# EAGLE design 6502 board (EAGLE 6.1)
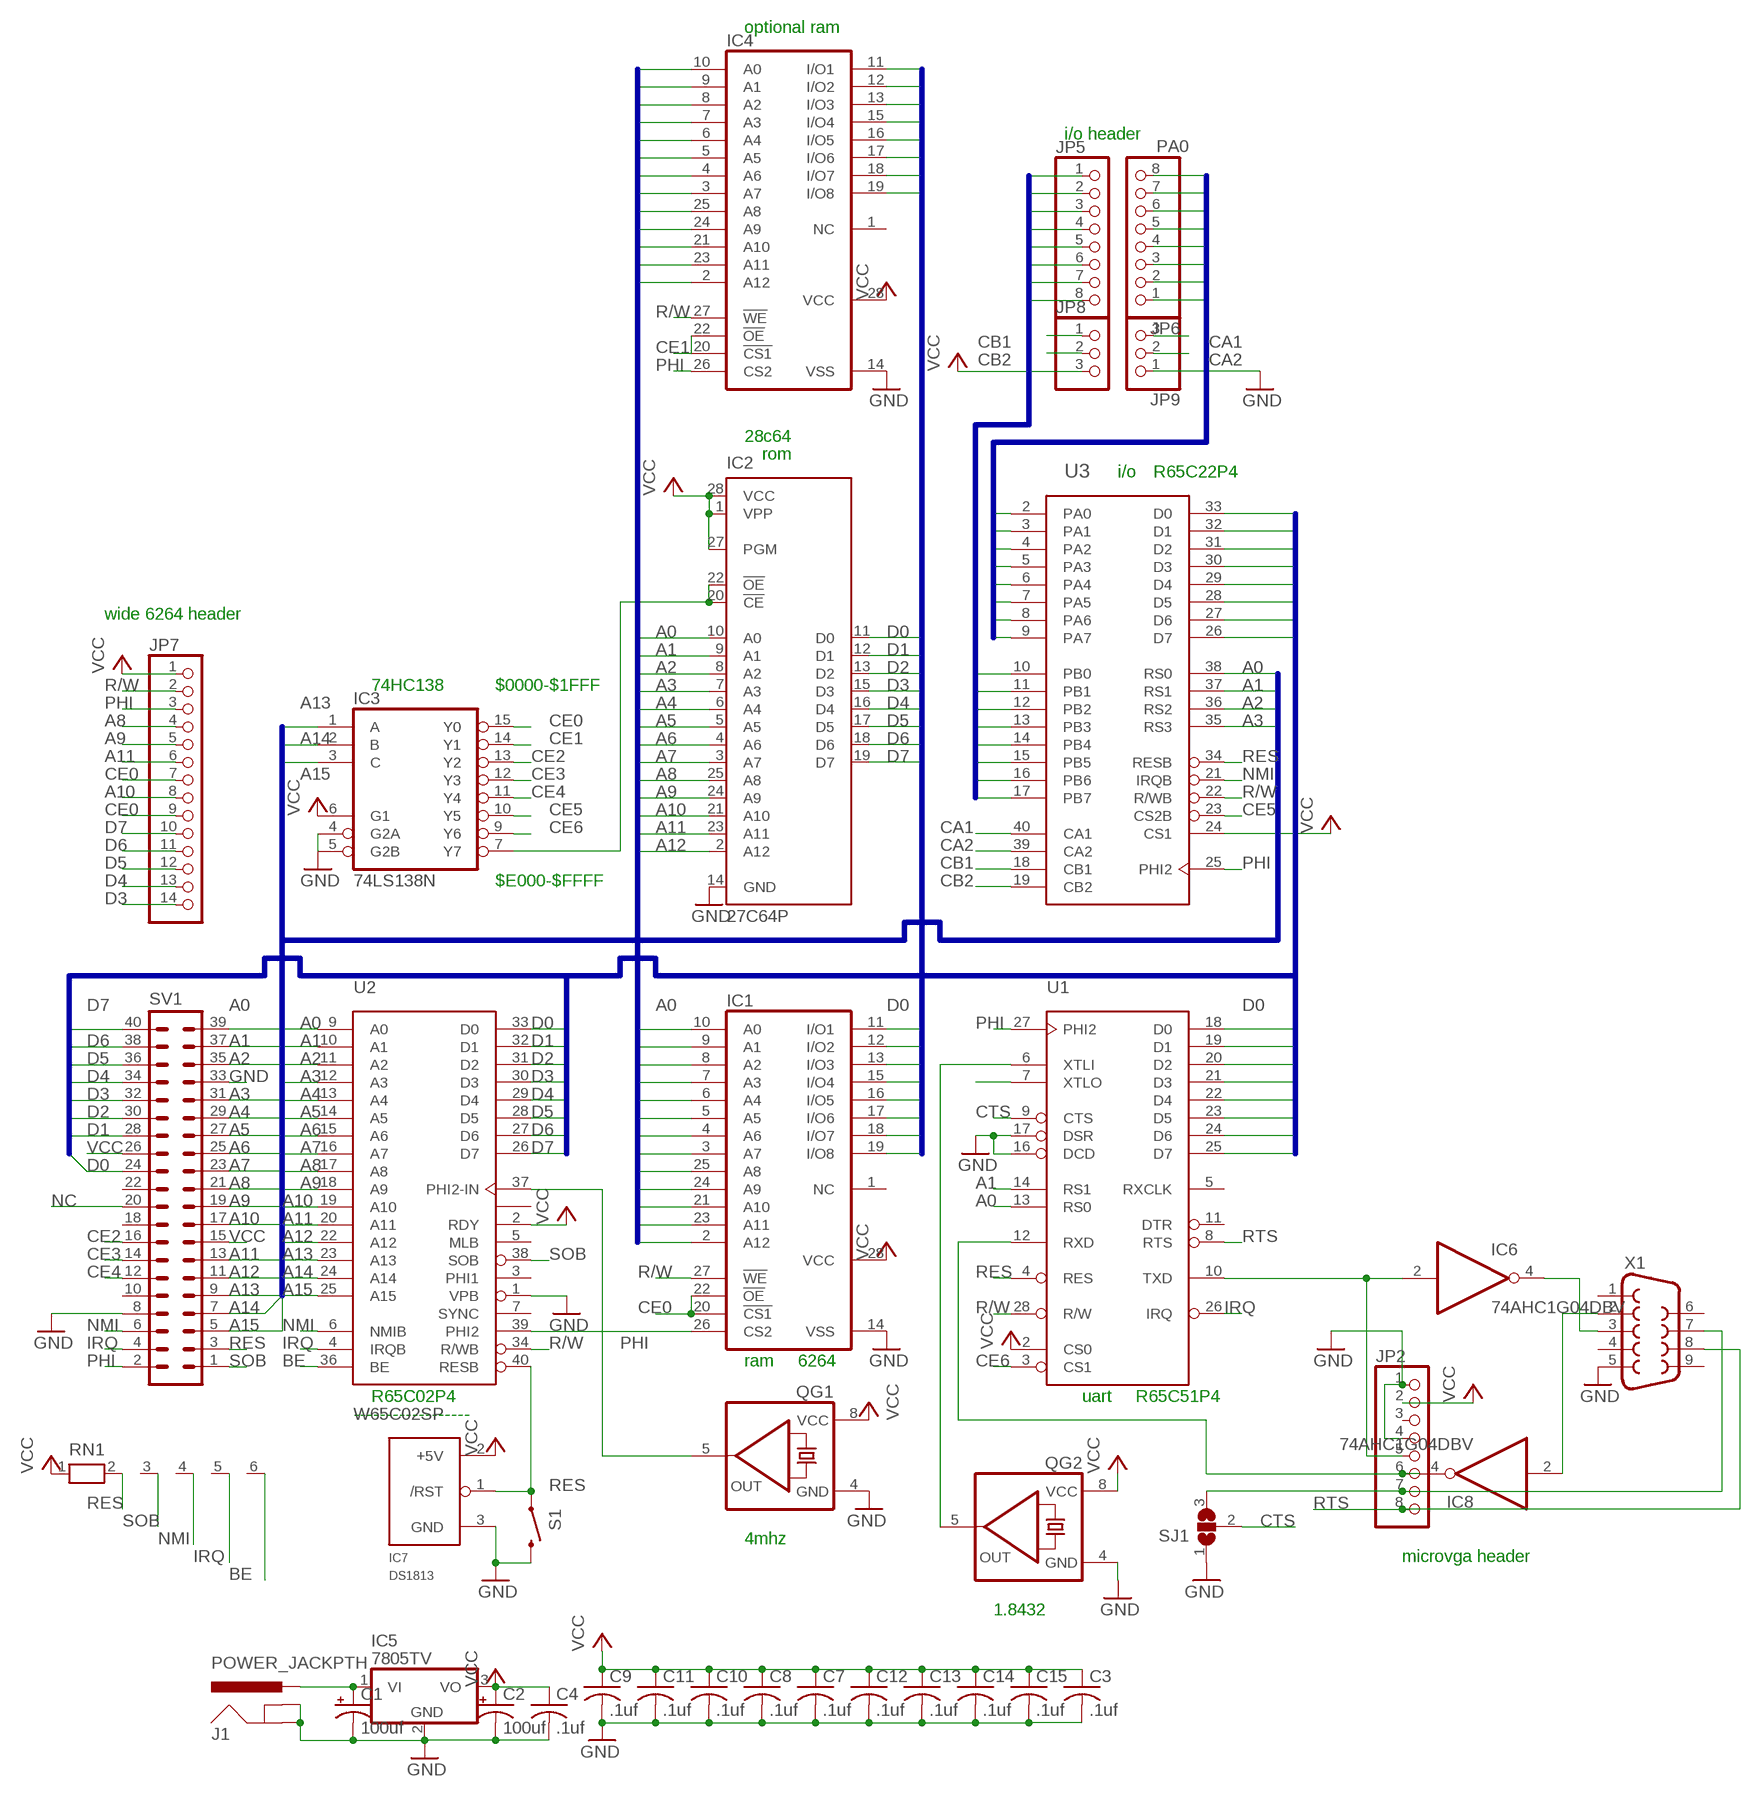
[diagram p0: schematic, sheet 1]

## Parts
C1  100uf  CPOL-USE3.5-8  [E3,5-8]
C2  100uf  CPOL-USE2.5-6  [E2,5-6]
C3  .1uf  C-US025-024X044  [C025-024X044]
C4  .1uf  C-US025-024X044  [C025-024X044]
C7  .1uf  C-US025-024X044  [C025-024X044]
C8  .1uf  C-US025-024X044  [C025-024X044]
C9  .1uf  C-US025-024X044  [C025-024X044]
C10  .1uf  C-US025-024X044  [C025-024X044]
C11  .1uf  C-US025-024X044  [C025-024X044]
C12  .1uf  C-US025-024X044  [C025-024X044]
C13  .1uf  C-US025-024X044  [C025-024X044]
C14  .1uf  C-US025-024X044  [C025-024X044]
C15  .1uf  C-US025-024X044  [C025-024X044]
IC1  6264ASMALL  [DIL28-3]
IC2  27C64P  [DIL28-6]
IC3  74LS138N  [DIL16]
IC4  6264ASMALL  [DIL28-3]
IC5  7805TV  [TO220V]
IC6  74AHC1G04DBV  [SOT23-5]
IC7  DS1813  [TO-92]
IC8  74AHC1G04DBV  [SOT23-5]
J1  POWER_JACKPTH  [POWER_JACK_PTH]
JP2  PINHD-1X8BIG  [1X08-BIG]
JP5  PINHD-1X8BIG  [1X08-BIG]
JP6  PINHD-1X8BIG  [1X08-BIG]
JP7  PINHD-1X14-CB  [1X14-CB]
JP8  PINHD-1X3  [1X03]
JP9  PINHD-1X3  [1X03]
QG1  QG5460  [DIL08S]
QG2  QG5460  [DIL08S]
RN1  RN05  [RN-6]
S1  SWITCH-MOMENTARY-2PTH  [TACTILE-PTH]
SJ1  SJ2WW  [SJ_2W]
SV1  ML40  [ML40]
U1  G65SC51P  [DIP-28]
U2  W65C02SP  [DIP-40]
U3  G65SC22P  [DIP-40]
X1  DB9FEMALE  [DB9]

## Nets
A0: IC1.10(A0) IC2.10(A0) IC4.10(A0) SV1.39 U1.13(RS0) U2.9(A0) U3.38(RS0)
A1: IC1.9(A1) IC2.9(A1) IC4.9(A1) SV1.37 U1.14(RS1) U2.10(A1) U3.37(RS1)
A2: IC1.8(A2) IC2.8(A2) IC4.8(A2) SV1.35 U2.11(A2) U3.36(RS2)
A3: IC1.7(A3) IC2.7(A3) IC4.7(A3) SV1.31 U2.12(A3) U3.35(RS3)
A4: IC1.6(A4) IC2.6(A4) IC4.6(A4) SV1.29 U2.13(A4)
A5: IC1.5(A5) IC2.5(A5) IC4.5(A5) SV1.27 U2.14(A5)
A6: IC1.4(A6) IC2.4(A6) IC4.4(A6) SV1.25 U2.15(A6)
A7: IC1.3(A7) IC2.3(A7) IC4.3(A7) SV1.23 U2.16(A7)
A8: IC1.25(A8) IC2.25(A8) IC4.25(A8) JP7.4 SV1.21 U2.17(A8)
A9: IC1.24(A9) IC2.24(A9) IC4.24(A9) JP7.5 SV1.19 U2.18(A9)
A10: IC1.21(A10) IC2.21(A10) IC4.21(A10) JP7.8 SV1.17 U2.19(A10)
A11: IC1.23(A11) IC2.23(A11) IC4.23(A11) JP7.6 SV1.13 U2.20(A11)
A12: IC1.2(A12) IC2.2(A12) IC4.2(A12) SV1.11 U2.22(A12)
A13: IC3.1(A) SV1.9 U2.23(A13)
A14: IC3.2(B) SV1.7 U2.24(A14)
A15: IC3.3(C) SV1.5 U2.25(A15)
BE: RN1.6 U2.36(BE)
CA1: JP9.3 U3.40(CA1)
CA2: JP9.2 U3.39(CA2)
CB1: JP8.1 U3.18(CB1)
CB2: JP8.2 U3.19(CB2)
CE0: IC1.20(!CS1) IC1.22(!OE) IC3.15(Y0) JP7.7 JP7.9
CE1: IC3.14(Y1) IC4.20(!CS1) IC4.22(!OE)
CE2: IC3.13(Y2) SV1.16
CE3: IC3.12(Y3) SV1.14
CE4: IC3.11(Y4) SV1.12
CE5: IC3.10(Y5) U3.23(CS2B)
CE6: IC3.9(Y6) U1.3(CS1)
CTS: SJ1.2 U1.9(CTS)
D0: IC1.11(I/O1) IC2.11(D0) IC4.11(I/O1) SV1.24 U1.18(D0) U2.33(D0) U3.33(D0)
D1: IC1.12(I/O2) IC2.12(D1) IC4.12(I/O2) SV1.28 U1.19(D1) U2.32(D1) U3.32(D1)
D2: IC1.13(I/O3) IC2.13(D2) IC4.13(I/O3) SV1.30 U1.20(D2) U2.31(D2) U3.31(D2)
D3: IC1.15(I/O4) IC2.15(D3) IC4.15(I/O4) JP7.14 SV1.32 U1.21(D3) U2.30(D3) U3.30(D3)
D4: IC1.16(I/O5) IC2.16(D4) IC4.16(I/O5) JP7.13 SV1.34 U1.22(D4) U2.29(D4) U3.29(D4)
D5: IC1.17(I/O6) IC2.17(D5) IC4.17(I/O6) JP7.12 SV1.36 U1.23(D5) U2.28(D5) U3.28(D5)
D6: IC1.18(I/O7) IC2.18(D6) IC4.18(I/O7) JP7.11 SV1.38 U1.24(D6) U2.27(D6) U3.27(D6)
D7: IC1.19(I/O8) IC2.19(D7) IC4.19(I/O8) JP7.10 SV1.40 U1.25(D7) U2.26(D7) U3.26(D7)
GND [power]: C1.- C2.- C3.2 C4.2 C7.2 C8.2 C9.2 C10.2 C11.2 C12.2 C13.2 C14.2 C15.2 IC1.14(VSS) IC2.14(GND) IC3.4(G2A) IC3.5(G2B) IC4.14(VSS) IC5.2(GND) IC7.3(GND) J1.GND J1.GNDBREAK JP2.1 JP2.4 JP9.1 QG1.4(GND) QG2.4(GND) S1.3 SJ1.1 SV1.8 SV1.33 U1.16(DCD) U1.17(DSR) U2.1(VPB) X1.5
IRQ: RN1.5 SV1.4 U1.26(IRQ) U2.4(IRQB)
N$1: QG1.5(OUT) U2.37(PHI2-IN)
N$2: IC2.20(!CE) IC2.22(!OE) IC3.7(Y7)
N$3: IC6.4(O) X1.3
N$4: IC8.2(I) X1.2
N$5: JP2.7 SJ1.3 X1.7
N$6: U1.7(XTLO)
N$7: QG2.5(OUT) U1.6(XTLI)
N$9: IC6.2(I) JP2.5 U1.10(TXD)
N$11: IC8.4(O) JP2.6 U1.12(RXD)
N$12 [power]: C1.+ IC5.1(VI) J1.PWR
NC: SV1.20
NMI: RN1.4 SV1.6 U2.6(NMIB) U3.21(IRQB)
PA0: JP6.8 U3.2(PA0)
PA1: JP6.7 U3.3(PA1)
PA2: JP6.6 U3.4(PA2)
PA3: JP6.5 U3.5(PA3)
PA4: JP6.4 U3.6(PA4)
PA5: JP6.3 U3.7(PA5)
PA6: JP6.2 U3.8(PA6)
PA7: JP6.1 U3.9(PA7)
PB0: JP5.1 U3.10(PB0)
PB1: JP5.2 U3.11(PB1)
PB2: JP5.3 U3.12(PB2)
PB3: JP5.4 U3.13(PB3)
PB4: JP5.5 U3.14(PB4)
PB5: JP5.6 U3.15(PB5)
PB6: JP5.7 U3.16(PB6)
PB7: JP5.8 U3.17(PB7)
PHI: IC1.26(CS2) IC4.26(CS2) JP7.3 SV1.2 U1.27(PHI2) U2.39(PHI2) U3.25(PHI2)
R/W: IC1.27(!WE) IC4.27(!WE) JP7.2 U1.28(R/W) U2.34(R/WB) U3.22(R/WB)
RES: IC7.1(/RST) RN1.2 S1.1 SV1.3 U1.4(RES) U2.40(RESB) U3.34(RESB)
RTS: JP2.8 U1.8(RTS) X1.8
SOB: RN1.3 SV1.1 U2.38(SOB)
VCC [power]: C2.+ C3.1 C4.1 C7.1 C8.1 C9.1 C10.1 C11.1 C12.1 C13.1 C14.1 C15.1 IC1.28(VCC) IC2.1(VPP) IC2.27(PGM) IC2.28(VCC) IC3.6(G1) IC4.28(VCC) IC5.3(VO) IC7.2(+5V) JP2.2 JP7.1 JP8.3 QG1.8(VCC) QG2.8(VCC) RN1.1 SV1.15 SV1.26 U1.2(CS0) U2.2(RDY) U3.24(CS1)
Unconnected: IC1.1(NC) IC2.26(NC) IC4.1(NC) JP2.3 SV1.10 SV1.18 SV1.22 U1.5(RXCLK) U1.11(DTR) U2.3(PHI1) U2.5(MLB) U2.7(SYNC) U2.35(NC) X1.1 X1.4 X1.6 X1.9

## Buses
A[0..15]
D[0..7]
PA[0..7]
PB[0..7]

## Notes on the sheet
- optional ram
- i/o header
- 28c64
- rom
- i/o | R65C22P4
- wide 6264 header
- 74HC138 | $0000-$1FFF
- $E000-$FFFF
- ram | 6264
- R65C02P4 | uart | R65C51P4
- ------------------
- 4mhz
- microvga header
- 1.8432

## Power pins joined to a net without a drawn wire
GND: IC3.8(GND) IC6.3(GND) IC8.3(GND)
VCC: IC3.16(VCC) IC6.5(VCC) IC8.5(VCC)
VDD: U1.15(VDD) U2.8(VDD) U3.20(VDD)
VSS: U1.1(VSS) U2.21(VSS) U3.1(VSS)

## Library data of the parts
C1 C2 = rcl:CPOL-US: POLARIZED CAPACITOR, American symbol
C3 C4 C7-C15 = rcl:C-US: CAPACITOR, American symbol
IC1 IC4 = memory-hitachi:6264A: MEMORY
IC2 = microchip:27*64: CMOS EPROM 64 K (8 K x 8), low voltage; MF: Arrow Electronics; MPN: M27C64A-10F1; OC_FARNELL: 1094265; OC_NEWARK: 93K7339
IC3 = 74xx-us:74*138: 3-line to 8-line DECODER/DEMULTIPLEXER
IC5 = linear:78*: Positive VOLTAGE REGULATOR Source: http://cache.national.com/ds/LM/LM78L05.pdf http://www.fairchildsemi.com/ds/LM/LM7805.pdf
IC6 IC8 = 74xx-little-us:74*1G04: INVERTER Gate
IC7 = ds1813_revised:DS1813
J1 = SparkFun:POWER_JACK: Power Jack This is the standard 5.5mm barrel jack for power. The PTH is the most common, proven, reliable, footprint. All others are experimental. The Slot footprint only works if the mill layer is transmitted to the PCB fab house so be warned. Spark Fun Electronics SKU : PRT-00119. Mating wall wart : TOL-00298 (and others)
JP2 JP5 JP6 = adafruit:PINHD-1X8: PIN HEADER
JP7 = adafruit:PINHD-1X14: PIN HEADER
JP8 JP9 = adafruit:PINHD-1X3: PIN HEADER
QG1 QG2 = crystal:QG5460: CRYSTAL RESONATOR; OC_FARNELL: unknown; OC_NEWARK: unknown
RN1 = resistor-net:RN05: RESISTOR NETWORK; OC_FARNELL: unknown; OC_NEWARK: unknown
S1 = SparkFun:SWITCH-MOMENTARY-2
SJ1 = jumper:SJ2W: SMD solder JUMPER
SV1 = con-harting-ml:ML40: HARTING; OC_FARNELL: unknown; OC_NEWARK: unknown
U1 = 65XXX:G65SC51P
U2 = 65XXX:W65C02SP
U3 = 65XXX:G65SC22P
X1 = SparkFun:DB9: DB9 Connector Standard DB9 (D-Sub 9) serial connector. Can be used for CAN bus as well as RS485 and RS232. Footprint production proven. Spark Fun Electronics SKU : PRT-00429

## Net classes
1 power: width 0.61 mm

## Board
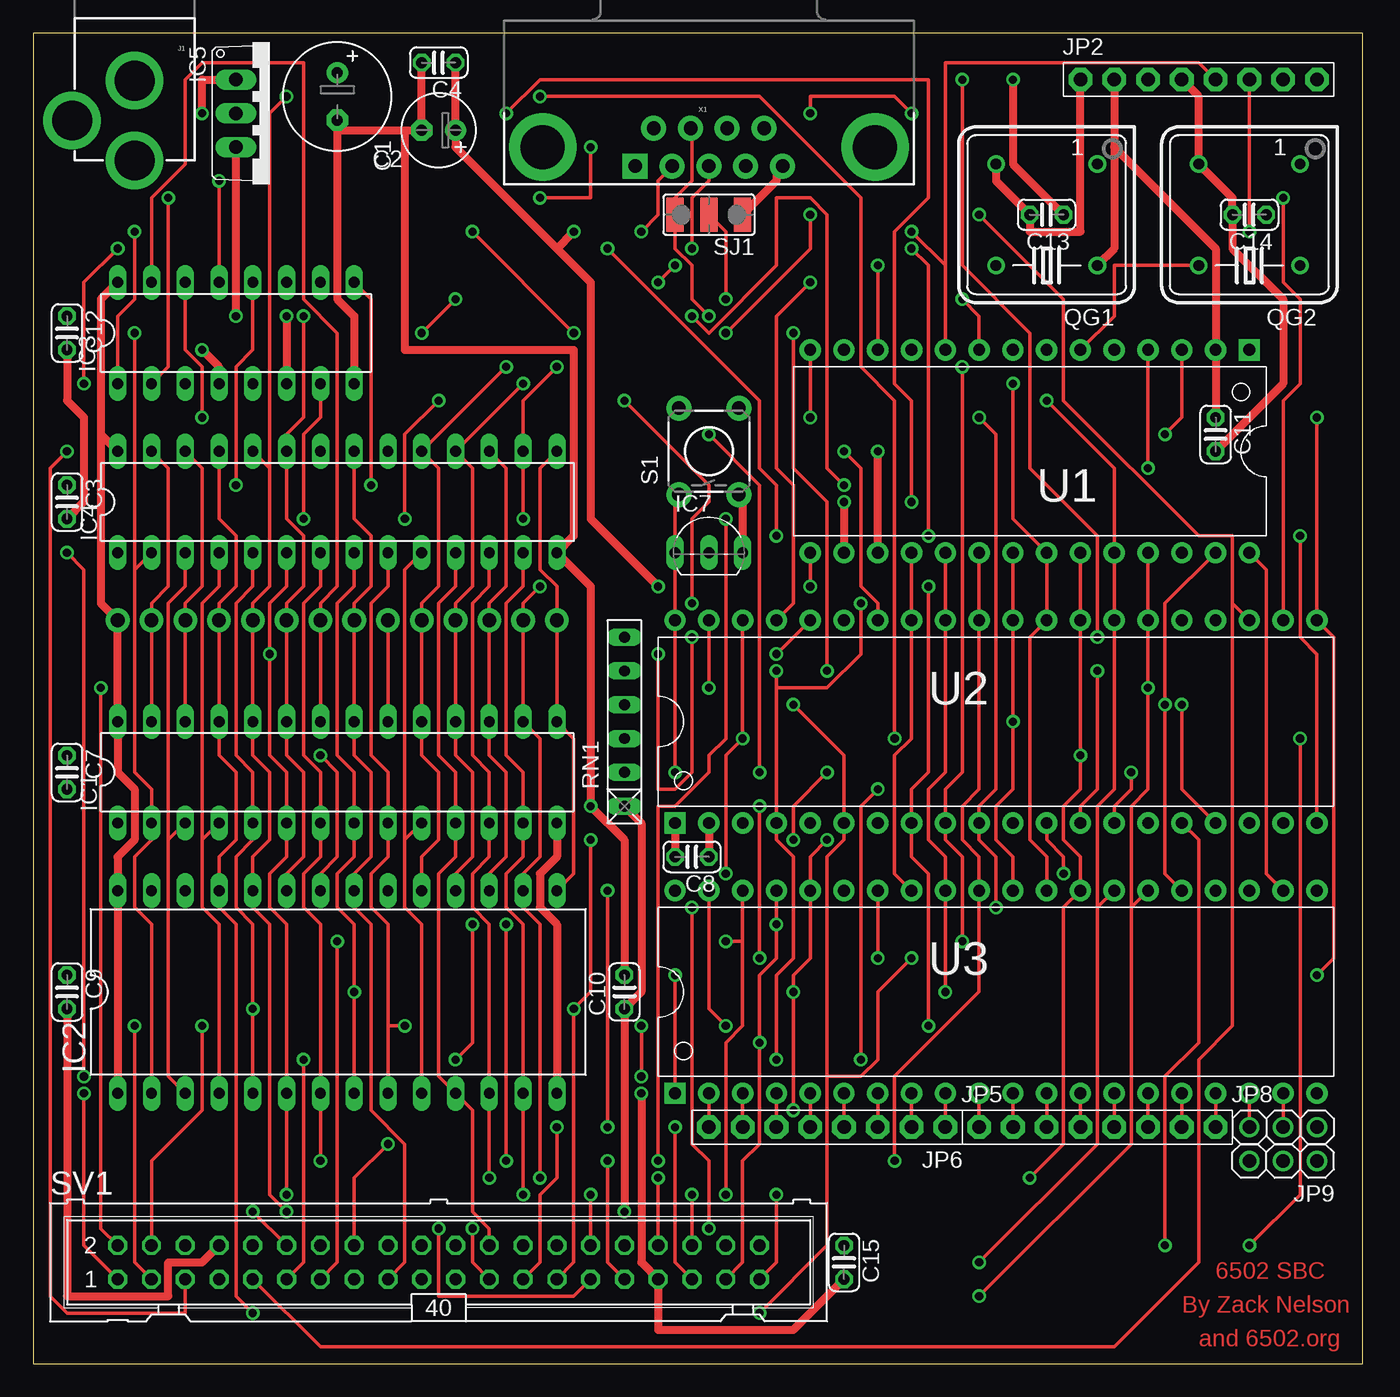
[diagram p1: board, top side]
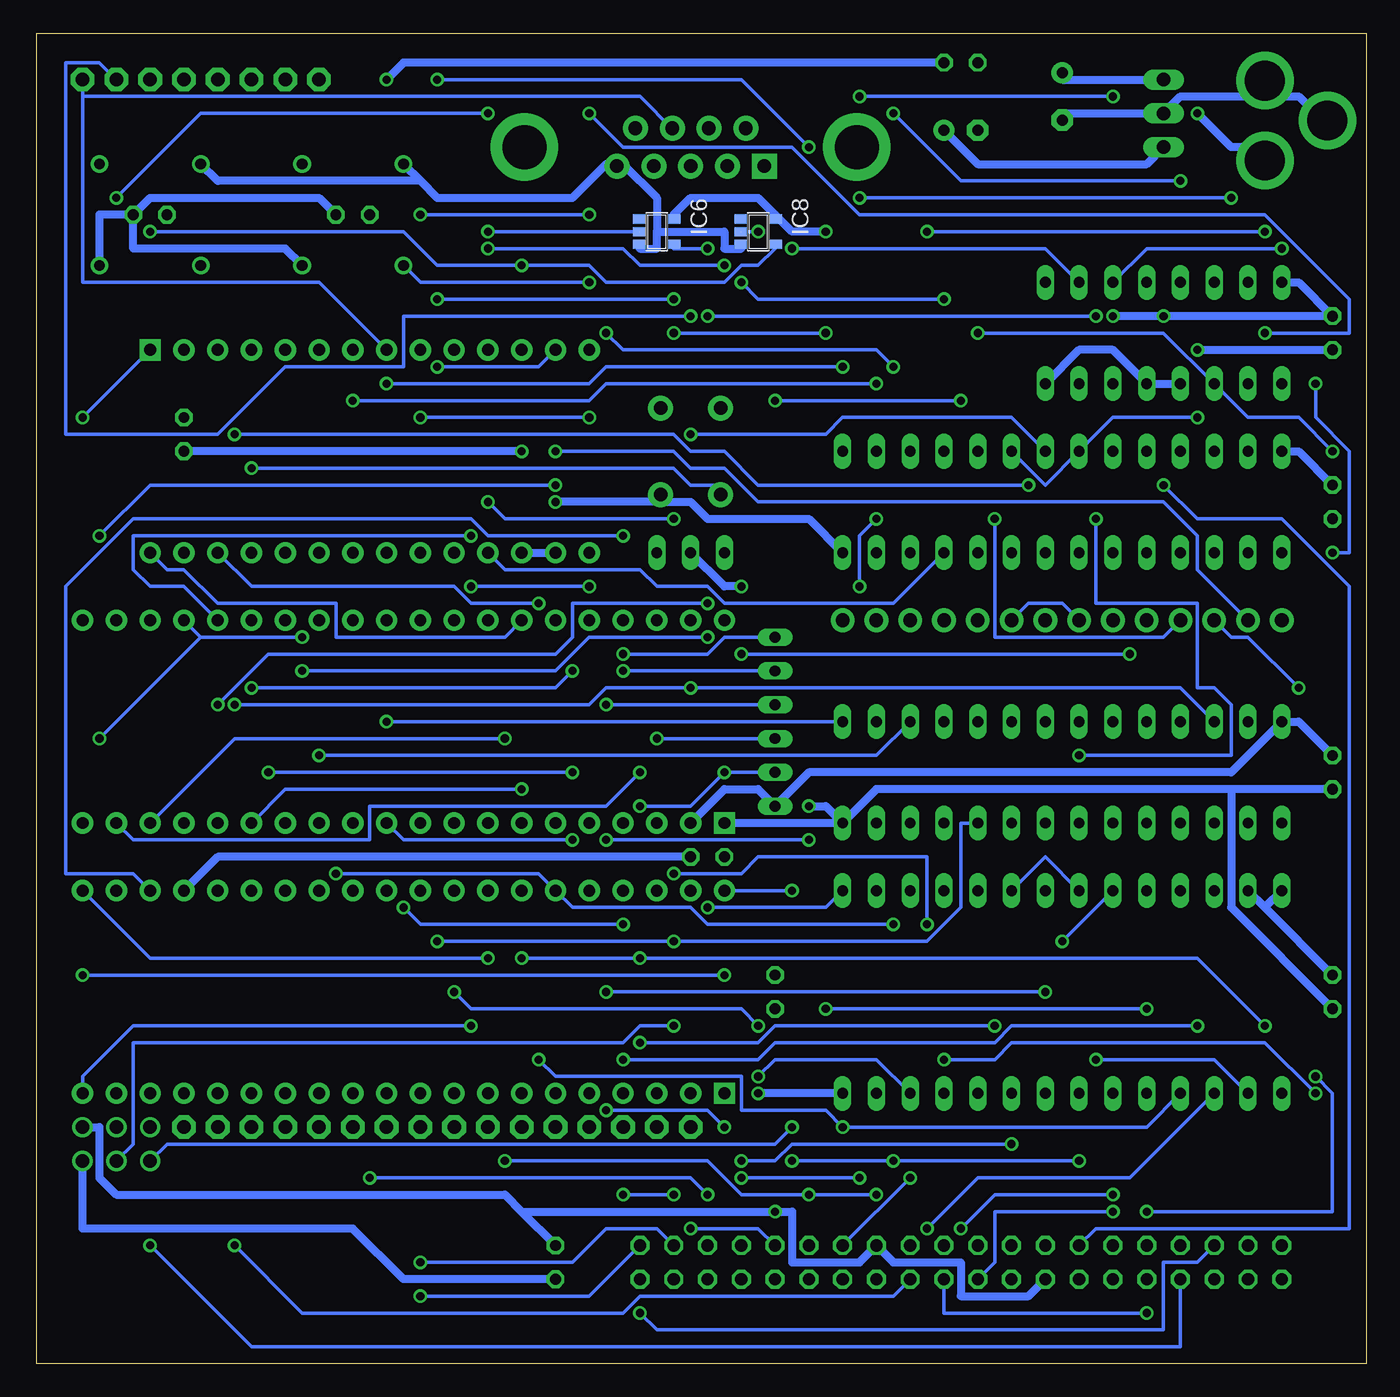
[diagram p2: board, bottom side, seen from below]

Size 99.98 x 100 mm. Coordinates in mm from the lower left corner, seen from the top.
Outline: 0,0 99.98,0 99.98,100 0,100 0,0
Copper layers (1*16): Top 0.035mm / dielectric 1.5mm / Bottom 0.035mm
Design rules: minimum track width 10mil, minimum drill 24mil, track to track 8mil, track to pad 8mil, pad to pad 8mil, via to via 8mil, smd to smd 8mil, copper to edge 40mil, drill to drill 8mil, minimum pad ring 10mil, minimum via ring 8mil, stop-mask expansion 4mil, vias tented up to drill 0mil, thermal gap 10mil

### Footprints (pad centres in the part's own frame; a part is rotated, then mirrored left to right if it is on the bottom)
E3,5-8 = drill 0.813 pad 1.6: + -1.778,0 | drill 0.813 pad 1.6 octagon: - 1.778,0
E2,5-6 = drill 0.813 pad 1.6: + -1.27,0 | drill 0.813 pad 1.6 octagon: - 1.27,0
C025-024X044 = drill 0.813 octagon: 1 -1.27,0; 2 1.27,0
DIL28-3 = drill 0.813 long: 1 -16.51,-3.81; 2 -13.97,-3.81; 3 -11.43,-3.81; 4 -8.89,-3.81; 5 -6.35,-3.81; 6 -3.81,-3.81; 7 -1.27,-3.81; 8 1.27,-3.81; 9 3.81,-3.81; 10 6.35,-3.81; 11 8.89,-3.81; 12 11.43,-3.81; 13 13.97,-3.81; 14 16.51,-3.81; 15 16.51,3.81; 16 13.97,3.81; 17 11.43,3.81; 18 8.89,3.81; 19 6.35,3.81; 20 3.81,3.81; 21 1.27,3.81; 22 -1.27,3.81; 23 -3.81,3.81; 24 -6.35,3.81; 25 -8.89,3.81; 26 -11.43,3.81; 27 -13.97,3.81; 28 -16.51,3.81
DIL28-6 = drill 0.813 long: 1 -16.51,-7.62; 2 -13.97,-7.62; 3 -11.43,-7.62; 4 -8.89,-7.62; 5 -6.35,-7.62; 6 -3.81,-7.62; 7 -1.27,-7.62; 8 1.27,-7.62; 9 3.81,-7.62; 10 6.35,-7.62; 11 8.89,-7.62; 12 11.43,-7.62; 13 13.97,-7.62; 14 16.51,-7.62; 15 16.51,7.62; 16 13.97,7.62; 17 11.43,7.62; 18 8.89,7.62; 19 6.35,7.62; 20 3.81,7.62; 21 1.27,7.62; 22 -1.27,7.62; 23 -3.81,7.62; 24 -6.35,7.62; 25 -8.89,7.62; 26 -11.43,7.62; 27 -13.97,7.62; 28 -16.51,7.62
DIL16 = drill 0.813 long: 1 -8.89,-3.81; 2 -6.35,-3.81; 3 -3.81,-3.81; 4 -1.27,-3.81; 5 1.27,-3.81; 6 3.81,-3.81; 7 6.35,-3.81; 8 8.89,-3.81; 9 8.89,3.81; 10 6.35,3.81; 11 3.81,3.81; 12 1.27,3.81; 13 -1.27,3.81; 14 -3.81,3.81; 15 -6.35,3.81; 16 -8.89,3.81
TO220V = drill 1.016 long: 1 -2.54,-2.54; 2 0,-2.54; 3 2.54,-2.54
SOT23-5 = smd 0.69 x 0.99: 1 -0.95,-1.29; 2 0,-1.29; 3 0.95,-1.29; 4 0.95,1.3; 5 -0.95,1.3
TO-92 = drill 0.813 long: 1 -2.54,0; 2 0,0; 3 2.54,0
POWER_JACK_PTH = drill 2.997 pad 4.318: GND 0,7.7; GNDBREAK 4.7,10.7; PWR 0,13.7
1X08-BIG = drill 1.016 pad 1.778 octagon: 1 -8.89,0; 2 -6.35,0; 3 -3.81,0; 4 -1.27,0; 5 1.27,0; 6 3.81,0; 7 6.35,0; 8 8.89,0
1X14-CB = drill 1.016 pad 1.778: 1 -16.51,0; 2 -13.97,0; 3 -11.43,0; 4 -8.89,0; 5 -6.35,0; 6 -3.81,0; 7 -1.27,0; 8 1.27,0; 9 3.81,0; 10 6.35,0; 11 8.89,0; 12 11.43,0; 13 13.97,0; 14 16.51,0
1X03 = drill 1.016: 1 -2.54,0; 2 0,0; 3 2.54,0
DIL08S = drill 0.813: 1 -3.81,-3.81; 4 3.81,-3.81; 5 3.81,3.81; 8 -3.81,3.81
RN-6 = drill 0.813 long: 1 -6.35,0; 2 -3.81,0; 3 -1.27,0; 4 1.27,0; 5 3.81,0; 6 6.35,0
TACTILE-PTH = drill 1.016 pad 1.88: 1 -3.251,2.261; 2 3.251,2.261; 3 -3.251,-2.261; 4 3.251,-2.261
SJ_2W = smd 1.27 x 2.54: 1 -2.54,0; 2 0,0; 3 2.54,0
ML40 = drill 0.914 octagon: 1 -24.13,-1.27; 2 -24.13,1.27; 3 -21.59,-1.27; 4 -21.59,1.27; 5 -19.05,-1.27; 6 -19.05,1.27; 7 -16.51,-1.27; 8 -16.51,1.27; 9 -13.97,-1.27; 10 -13.97,1.27; 11 -11.43,-1.27; 12 -11.43,1.27; 13 -8.89,-1.27; 14 -8.89,1.27; 15 -6.35,-1.27; 16 -6.35,1.27; 17 -3.81,-1.27; 18 -3.81,1.27; 19 -1.27,-1.27; 20 -1.27,1.27; 21 1.27,-1.27; 22 1.27,1.27; 23 3.81,-1.27; 24 3.81,1.27; 25 6.35,-1.27; 26 6.35,1.27; 27 8.89,-1.27; 28 8.89,1.27; 29 11.43,-1.27; 30 11.43,1.27; 31 13.97,-1.27; 32 13.97,1.27; 33 16.51,-1.27; 34 16.51,1.27; 35 19.05,-1.27; 36 19.05,1.27; 37 21.59,-1.27; 38 21.59,1.27; 39 24.13,-1.27; 40 24.13,1.27
DIP-28 = drill 0.889 pad 1.6 square: 1 -15.24,-7.62 | drill 0.889 pad 1.6: 2 -12.7,-7.62; 3 -10.16,-7.62; 4 -7.62,-7.62; 5 -5.08,-7.62; 6 -2.54,-7.62; 7 0,-7.62; 8 2.54,-7.62; 9 5.08,-7.62; 10 7.62,-7.62; 11 10.16,-7.62; 12 12.7,-7.62; 13 15.24,-7.62; 14 17.78,-7.62; 15 17.78,7.62; 16 15.24,7.62; 17 12.7,7.62; 18 10.16,7.62; 19 7.62,7.62; 20 5.08,7.62; 21 2.54,7.62; 22 0,7.62; 23 -2.54,7.62; 24 -5.08,7.62; 25 -7.62,7.62; 26 -10.16,7.62; 27 -12.7,7.62; 28 -15.24,7.62
DIP-40 = drill 0.889 pad 1.6 square: 1 -22.86,-7.62 | drill 0.889 pad 1.6: 2 -20.32,-7.62; 3 -17.78,-7.62; 4 -15.24,-7.62; 5 -12.7,-7.62; 6 -10.16,-7.62; 7 -7.62,-7.62; 8 -5.08,-7.62; 9 -2.54,-7.62; 10 0,-7.62; 11 2.54,-7.62; 12 5.08,-7.62; 13 7.62,-7.62; 14 10.16,-7.62; 15 12.7,-7.62; 16 15.24,-7.62; 17 17.78,-7.62; 18 20.32,-7.62; 19 22.86,-7.62; 20 25.4,-7.62; 21 25.4,7.62; 22 22.86,7.62; 23 20.32,7.62; 24 17.78,7.62; 25 15.24,7.62; 26 12.7,7.62; 27 10.16,7.62; 28 7.62,7.62; 29 5.08,7.62; 30 2.54,7.62; 31 0,7.62; 32 -2.54,7.62; 33 -5.08,7.62; 34 -7.62,7.62; 35 -10.16,7.62; 36 -12.7,7.62; 37 -15.24,7.62; 38 -17.78,7.62; 39 -20.32,7.62; 40 -22.86,7.62
DB9 = drill 1.016 pad 1.88 square: 1 -5.54,-1.42 | drill 1.016 pad 1.88: 2 -2.77,-1.42; 3 0,-1.42; 4 2.77,-1.42; 5 5.54,-1.42; 6 -4.15,1.42; 7 -1.38,1.42; 8 1.38,1.42; 9 4.15,1.42 | drill 3.302 pad 5.08: G1 -12.5,0; G2 12.5,0

### Placement (x,y rotation side)
C1  22.86,95.25 270 top
C2  30.48,92.71 180 top
C3  2.54,64.77 270 top
C4  30.48,97.79 180 top
C7  2.54,44.45 270 top
C8  49.53,38.1 180 top
C9  2.54,27.94 270 top
C10  44.45,27.94 90 top
C11  88.9,69.85 270 top
C12  2.54,77.47 270 top
C13  76.2,86.36 180 top
C14  91.44,86.36 180 top
C15  60.96,7.62 270 top
IC1  22.86,44.45 0 top
IC2  22.86,27.94 0 top
IC3  15.24,77.47 0 top
IC4  22.86,64.77 0 top
IC5  17.78,93.98 270 top
IC6  53.34,85.09 270 bottom
IC7  50.8,60.96 0 top
IC8  45.72,85.09 270 bottom
J1  7.62,104.14 180 top
JP2  87.63,96.52 0 top
JP5  80.01,17.78 0 top
JP6  59.69,17.78 180 top
JP7  22.86,55.88 0 top
JP8  93.98,17.78 0 top
JP9  93.98,15.24 180 top
QG1  76.2,86.36 180 top
QG2  91.44,86.36 180 top
RN1  44.45,48.26 90 top
S1  50.8,68.58 90 top
SJ1  50.8,86.36 180 top
SV1  30.48,7.62 0 top
U1  76.2,68.58 180 top
U2  71.12,48.26 0 top
U3  71.12,27.94 0 top
X1  50.8,91.44 0 top

### Tracks (layer width: path | path; a pad name or v marks a point on that pad's centre or on a via)
A0  (via drill 0.61)
  Top 0.254: v69.85,74.93 69.85,44.45 68.58,43.18 U2.9 68.58,39.37 69.85,38.1 v69.85,31.75 | SV1.39 55.88,7.62 v55.88,12.7 | v52.07,12.7 52.07,24.13 53.34,25.4 53.34,31.75 | U3.38 53.34,31.75 | IC2.10 29.21,33.02 27.94,34.29 27.94,39.37 | IC1.10 27.94,39.37 | IC4.10 27.94,59.69 27.94,39.37 | v52.07,31.75 53.34,31.75
  Bottom 0.254: v69.85,74.93 62.23,74.93 U1.13 | v52.07,12.7 v55.88,12.7 | IC1.10 30.48,40.64 30.48,34.29 33.02,31.75 v52.07,31.75 v69.85,31.75
A1  (via drill 0.61)
  Top 0.254: 26.67,25.4 26.67,33.02 25.4,34.29 25.4,36.83 26.67,38.1 IC1.9 26.67,44.45 25.4,45.72 25.4,57.15 26.67,58.42 IC4.9 | 26.67,25.4 IC2.9 | SV1.37 53.34,7.62 53.34,15.24 54.61,16.51 v54.61,24.13 54.61,29.21 55.88,30.48 v55.88,33.02 U3.37 | v72.39,34.29 72.39,38.1 71.12,39.37 U2.10 71.12,41.91 72.39,43.18 72.39,69.85 v71.12,71.12 | v58.42,71.12 U1.14 | v27.94,25.4 26.67,25.4
  Bottom 0.254: v72.39,34.29 71.12,33.02 v55.88,33.02 | v71.12,71.12 v58.42,71.12 | v27.94,25.4 44.45,25.4 45.72,24.13 v54.61,24.13
A2  (via drill 0.61)
  Top 0.254: IC2.8 v24.13,27.94 24.13,33.02 22.86,34.29 22.86,36.83 24.13,38.1 IC1.8 24.13,44.45 22.86,45.72 22.86,57.15 24.13,58.42 IC4.8 | SV1.35 48.26,7.62 v48.26,17.78 | v57.15,19.05 v57.15,27.94 57.15,29.21 58.42,30.48 U3.36 58.42,38.1 v59.69,39.37
  Bottom 0.254: v48.26,17.78 49.53,19.05 v57.15,19.05 | U2.11 72.39,39.37 v59.69,39.37 | v57.15,27.94 v24.13,27.94
A3  (via drill 0.61)
  Top 0.254: v77.47,36.83 77.47,38.1 76.2,39.37 U2.12 | IC4.7 21.59,58.42 20.32,57.15 20.32,45.72 21.59,44.45 IC1.7 21.59,38.1 20.32,36.83 20.32,34.29 21.59,33.02 IC2.7 v21.59,15.24 | SV1.31 43.18,7.62 v43.18,15.24 | v35.56,15.24 v35.56,33.02
  Bottom 0.254: v77.47,36.83 62.23,36.83 U3.35 59.69,34.29 50.8,34.29 49.53,33.02 v35.56,33.02 | v21.59,15.24 v35.56,15.24 v43.18,15.24
A4  (via drill 0.61)
  Top 0.254: IC4.6 19.05,58.42 17.78,57.15 v17.78,53.34 17.78,45.72 19.05,44.45 IC1.6 19.05,38.1 17.78,36.83 17.78,34.29 19.05,33.02 IC2.6 v19.05,12.7 | SV1.29 40.64,5.08 30.48,5.08 v30.48,10.16 | U2.13 78.74,41.91 80.01,43.18 v80.01,52.07 | v49.53,54.61 49.53,44.45 48.26,43.18 46.99,43.18 v46.99,53.34
  Bottom 0.254: v30.48,10.16 27.94,12.7 v19.05,12.7 | v80.01,52.07 60.96,52.07 58.42,54.61 v49.53,54.61 | v17.78,53.34 v46.99,53.34
A5  (via drill 0.61)
  Top 0.254: IC2.5 v16.51,26.67 16.51,33.02 15.24,34.29 15.24,38.1 16.51,39.37 IC1.5 16.51,44.45 15.24,45.72 15.24,57.15 16.51,58.42 IC4.5 | SV1.27 40.64,7.62 v40.64,26.67 41.91,27.94 v41.91,39.37 | U2.14 81.28,41.91 82.55,43.18 v82.55,44.45 | v59.69,44.45 57.15,41.91 v57.15,39.37
  Bottom 0.254: v16.51,26.67 v40.64,26.67 | v59.69,44.45 v82.55,44.45 | v41.91,39.37 v57.15,39.37
A6  (via drill 0.61)
  Top 0.254: IC2.4 13.97,33.02 12.7,34.29 12.7,39.37 | IC1.4 12.7,39.37 | IC4.4 13.97,58.42 12.7,57.15 12.7,39.37 | SV1.25 38.1,7.62 38.1,12.7 39.37,13.97 v39.37,17.78 | v63.5,43.18 62.23,41.91 v62.23,22.86
  Bottom 0.254: IC2.4 16.51,17.78 v39.37,17.78 40.64,19.05 46.99,19.05 46.99,21.59 60.96,21.59 v62.23,22.86 | U2.15 81.28,43.18 v63.5,43.18
A7  (via drill 0.61)
  Top 0.254: IC2.3 10.16,21.59 10.16,39.37 | IC1.3 10.16,39.37 | IC4.3 11.43,58.42 10.16,57.15 10.16,39.37 | SV1.23 33.02,7.62 v33.02,10.16 | U2.16 87.63,39.37 87.63,24.13 85.09,21.59 v85.09,8.89
  Bottom 0.254: v33.02,10.16 29.21,13.97 17.78,13.97 IC2.3 | v85.09,8.89 80.01,3.81 55.88,3.81 54.61,5.08 35.56,5.08 SV1.23
A8  (via drill 0.61)
  Top 0.254: v16.51,3.81 15.24,5.08 15.24,33.02 13.97,34.29 IC2.25 13.97,38.1 15.24,39.37 15.24,44.45 13.97,45.72 IC1.25 JP7.4 13.97,57.15 15.24,58.42 15.24,62.23 13.97,63.5 IC4.25 | U2.17 86.36,43.18 v86.36,49.53 | v49.53,57.15 49.53,63.5 50.8,64.77 50.8,66.04 v44.45,72.39 | v30.48,72.39 27.94,69.85 v27.94,63.5
  Bottom 0.254: SV1.21 31.75,3.81 v16.51,3.81 | v86.36,49.53 82.55,53.34 60.96,53.34 59.69,54.61 59.69,57.15 v49.53,57.15 | v30.48,72.39 v44.45,72.39 | v27.94,63.5 27.94,54.61 15.24,54.61 JP7.4
A9  (via drill 0.61)
  Top 0.254: v19.05,11.43 17.78,12.7 17.78,33.02 16.51,34.29 IC2.24 16.51,38.1 17.78,39.37 17.78,44.45 16.51,45.72 IC1.24 JP7.5 16.51,57.15 17.78,58.42 17.78,67.31 | 17.78,67.31 IC4.24 | v64.77,46.99 64.77,72.39 62.23,74.93 62.23,87.63 54.61,95.25 v38.1,95.25 | v19.05,95.25 17.78,93.98 17.78,67.31
  Bottom 0.254: SV1.19 27.94,7.62 27.94,11.43 v19.05,11.43 | U2.18 85.09,46.99 v64.77,46.99 | v19.05,95.25 v38.1,95.25
A10  (via drill 0.61)
  Top 0.254: SV1.17 27.94,7.62 27.94,16.51 25.4,19.05 25.4,33.02 24.13,34.29 IC2.21 24.13,36.83 25.4,38.1 25.4,44.45 24.13,45.72 IC1.21 JP7.8 24.13,57.15 25.4,58.42 25.4,62.23 24.13,63.5 IC4.21 | v54.61,44.45 54.61,66.04 v50.8,69.85
  Bottom 0.254: U2.19 92.71,39.37 74.93,39.37 74.93,41.91 57.15,41.91 v54.61,44.45 | v50.8,69.85 40.64,69.85 39.37,71.12 26.67,71.12 IC4.21
A11  (via drill 0.61)
  Top 0.254: IC2.23 19.05,36.83 20.32,38.1 20.32,44.45 19.05,45.72 IC1.23 JP7.6 19.05,57.15 20.32,58.42 20.32,62.23 19.05,63.5 IC4.23 19.05,69.85 20.32,71.12 v20.32,78.74 | SV1.13 22.86,7.62 v22.86,31.75 | U2.20 96.52,53.34 95.25,54.61 v95.25,62.23 | v60.96,66.04 59.69,67.31 59.69,86.36 58.42,87.63 55.88,87.63 55.88,82.55 50.8,77.47 v49.53,78.74
  Bottom 0.254: IC2.23 v22.86,31.75 | v95.25,62.23 91.44,66.04 v60.96,66.04 | v20.32,78.74 v49.53,78.74
A12  (via drill 0.61)
  Top 0.254: IC2.2 8.89,33.02 7.62,34.29 7.62,38.1 8.89,39.37 IC1.2 8.89,43.18 7.62,44.45 7.62,59.69 | 7.62,59.69 IC4.2 | SV1.11 20.32,7.62 v20.32,22.86 | U2.22 93.98,72.39 95.25,73.66 95.25,80.01 93.98,81.28 v93.98,87.63 | v66.04,93.98 64.77,95.25 58.42,95.25 v58.42,93.98 | 7.62,59.69 v7.62,77.47
  Bottom 0.254: v20.32,22.86 11.43,22.86 IC2.2 | v93.98,87.63 87.63,93.98 v66.04,93.98 | v58.42,93.98 55.88,91.44 43.18,91.44 38.1,86.36 7.62,86.36 1.27,80.01 1.27,77.47 v7.62,77.47
A13  (via drill 0.61)
  Top 0.254: IC3.1 6.35,78.74 7.62,80.01 v7.62,85.09 | v40.64,77.47 v33.02,85.09 | v52.07,77.47 58.42,83.82 v58.42,86.36 | v71.12,86.36 77.47,80.01 77.47,72.39 87.63,62.23 90.17,62.23 90.17,57.15 | U2.23 90.17,57.15 | SV1.9 21.59,1.27 81.28,1.27 87.63,7.62 87.63,22.86 90.17,25.4 90.17,57.15
  Bottom 0.254: v33.02,85.09 v7.62,85.09 | v52.07,77.47 v40.64,77.47 | v71.12,86.36 v58.42,86.36
A14  (via drill 0.61)
  Top 0.254: IC3.2 10.16,74.93 v10.16,87.63 | v38.1,87.63 41.91,87.63 v41.91,91.44 | v69.85,96.52 69.85,82.55 74.93,77.47 74.93,67.31 80.01,62.23 v80.01,54.61 | v91.44,8.89 95.25,12.7 v95.25,46.99
  Bottom 0.254: v38.1,87.63 v10.16,87.63 | v41.91,91.44 46.99,96.52 v69.85,96.52 | 87.63,54.61 v80.01,54.61 | U2.24 87.63,54.61 | SV1.7 13.97,1.27 83.82,1.27 v91.44,8.89 | 87.63,54.61 v95.25,46.99
A15  (via drill 0.61)
  Top 0.254: v2.54,68.58 1.27,67.31 1.27,5.08 2.54,3.81 11.43,3.81 SV1.5 | v67.31,62.23 67.31,82.55 v66.04,83.82 | v46.99,81.28 v48.26,82.55 | v29.21,77.47 v31.75,80.01
  Bottom 0.254: v2.54,68.58 5.08,71.12 8.89,71.12 IC3.3 15.24,77.47 v29.21,77.47 | U2.25 88.9,58.42 91.44,58.42 92.71,59.69 92.71,62.23 v67.31,62.23 | v66.04,83.82 55.88,83.82 54.61,82.55 v48.26,82.55 | v46.99,81.28 45.72,80.01 v31.75,80.01
BE  (via drill 0.61)
  Top 0.254: U2.36 v55.88,53.34
  Bottom 0.254: RN1.6 48.26,54.61 49.53,53.34 v55.88,53.34
CA1  (via drill 0.61)
  Top 0.254: v43.18,35.56 v43.18,17.78
  Bottom 0.254: JP9.3 90.17,16.51 44.45,16.51 v43.18,17.78 | U3.40 v43.18,35.56
CA2  (via drill 0.61)
  Top 0.254: v52.07,25.4 50.8,26.67 U3.39
  Bottom 0.254: JP9.2 92.71,16.51 92.71,24.13 55.88,24.13 54.61,25.4 v52.07,25.4
CB1
  Top 0.254: U3.18 JP8.1
CB2
  Top 0.254: U3.19 JP8.2
CE0
  Top 0.254: JP7.9 IC1.20 | IC1.22 JP7.7 21.59,57.15 22.86,58.42 22.86,77.47 20.32,80.01 20.32,97.79 12.7,97.79 11.43,96.52 11.43,90.17 8.89,87.63 IC3.15
  Bottom 0.254: JP7.9 25.4,57.15 22.86,57.15 JP7.7
CE1  (via drill 0.61)
  Top 0.254: IC3.14 11.43,76.2 12.7,74.93 v12.7,71.12
  Bottom 0.254: IC4.20 24.13,66.04 IC4.22 19.05,71.12 v12.7,71.12
CE2  (via drill 0.61)
  Top 0.254: v13.97,88.9 IC3.13 | v35.56,93.98 38.1,96.52 67.31,96.52 67.31,87.63 64.77,85.09 64.77,73.66 66.04,72.39 v66.04,64.77 | v52.07,63.5 52.07,46.99 50.8,45.72 50.8,44.45 48.26,41.91 46.99,41.91 v46.99,15.24 | v26.67,16.51 24.13,13.97 SV1.16
  Bottom 0.254: v13.97,88.9 30.48,88.9 v35.56,93.98 | v66.04,64.77 64.77,63.5 v52.07,63.5 | v46.99,15.24 44.45,15.24 43.18,16.51 v26.67,16.51
CE3  (via drill 0.61)
  Top 0.254: IC3.12 16.51,76.2 15.24,74.93 v15.24,66.04
  Bottom 0.254: v15.24,66.04 12.7,63.5 6.35,63.5 1.27,58.42 1.27,10.16 20.32,10.16 SV1.14
CE4  (via drill 0.61)
  Top 0.254: v6.35,83.82 3.81,81.28 v3.81,73.66 | v2.54,60.96 3.81,59.69 v3.81,21.59 | SV1.12 v16.51,11.43
  Bottom 0.254: IC3.11 16.51,83.82 v6.35,83.82 | v3.81,73.66 3.81,71.12 1.27,68.58 1.27,60.96 v2.54,60.96 | v3.81,21.59 2.54,20.32 2.54,11.43 v16.51,11.43
CE5  (via drill 0.61)
  Top 0.254: v43.18,83.82 54.61,72.39 54.61,67.31 55.88,66.04 v55.88,62.23
  Bottom 0.254: IC3.10 24.13,83.82 v43.18,83.82 | v55.88,62.23 66.04,62.23 67.31,63.5 92.71,63.5 97.79,58.42 97.79,36.83 92.71,36.83 U3.23
CE6  (via drill 0.61)
  Top 0.254: IC3.9 25.4,80.01 v25.4,66.04 | v85.09,69.85 86.36,71.12 U1.3
  Bottom 0.254: v25.4,66.04 45.72,66.04 48.26,68.58 50.8,68.58 52.07,69.85 v85.09,69.85
CTS  (via drill 0.61)
  Top 0.254: SJ1.2 52.07,85.09 v52.07,80.01 | v69.85,80.01 71.12,78.74 U1.9
  Bottom 0.254: v69.85,80.01 v52.07,80.01
D0
  Top 0.254: U3.33 64.77,36.83 64.77,45.72 66.04,46.99 U2.33 U1.18 | SV1.24 34.29,10.16 33.02,11.43 33.02,19.05 IC2.11 30.48,21.59 30.48,36.83 31.75,38.1 IC1.11 31.75,44.45 30.48,45.72 30.48,57.15 31.75,58.42 IC4.11
  Bottom 0.254: U1.18 64.77,59.69 54.61,59.69 53.34,58.42 49.53,58.42 48.26,57.15 35.56,57.15 IC4.11
D1  (via drill 0.61)
  Top 0.254: U1.19 U2.32 68.58,44.45 67.31,43.18 67.31,39.37 68.58,38.1 U3.32 v68.58,27.94 | IC4.12 34.29,58.42 33.02,57.15 33.02,45.72 34.29,44.45 IC1.12 34.29,38.1 33.02,36.83 33.02,34.29 34.29,33.02 IC2.12 v34.29,13.97 | v45.72,21.59 v45.72,25.4
  Bottom 0.254: v34.29,13.97 SV1.28 | v68.58,27.94 67.31,26.67 46.99,26.67 v45.72,25.4 | v45.72,21.59 44.45,22.86 36.83,22.86 IC2.12
D2  (via drill 0.61)
  Top 0.254: U1.20 U2.31 71.12,43.18 69.85,41.91 69.85,39.37 71.12,38.1 U3.31 71.12,27.94 64.77,21.59 v64.77,15.24 | IC4.13 36.83,58.42 35.56,57.15 35.56,45.72 36.83,44.45 IC1.13 36.83,38.1 35.56,36.83 35.56,34.29 36.83,33.02 IC2.13 v36.83,12.7 | v41.91,12.7 SV1.30
  Bottom 0.254: v36.83,12.7 v41.91,12.7 46.99,12.7 49.53,15.24 v64.77,15.24
D3  (via drill 0.61)
  Top 0.254: U3.30 73.66,38.1 72.39,39.37 72.39,41.91 73.66,43.18 v73.66,48.26 U2.30 U1.21 | IC4.15 38.1,67.31 38.1,59.69 39.37,58.42 JP7.14 IC1.15 40.64,46.99 40.64,36.83 IC2.15 | v50.8,10.16 50.8,15.24 49.53,16.51 v49.53,34.29
  Bottom 0.254: SV1.32 45.72,10.16 v50.8,10.16 | v49.53,34.29 40.64,34.29 IC2.15 | IC1.15 v73.66,48.26
D4  (via drill 0.61)
  Top 0.254: U3.29 76.2,38.1 74.93,39.37 74.93,54.61 U2.29 U1.22 73.66,63.5 v73.66,73.66 | v36.83,63.5 IC4.16 36.83,72.39 v39.37,74.93 | v38.1,58.42 36.83,57.15 JP7.13 IC1.16 38.1,46.99 38.1,38.1 36.83,36.83 IC2.16 36.83,34.29 38.1,33.02 v38.1,13.97 | v46.99,13.97 SV1.34
  Bottom 0.254: v36.83,63.5 38.1,62.23 v38.1,58.42 | v38.1,13.97 v46.99,13.97 | v73.66,73.66 58.42,73.66 57.15,74.93 v39.37,74.93
D5  (via drill 0.61)
  Top 0.254: IC2.17 34.29,36.83 35.56,38.1 35.56,44.45 34.29,45.72 IC1.17 JP7.12 34.29,57.15 35.56,58.42 35.56,67.31 IC4.17 | U1.23 U2.28 v78.74,45.72 78.74,43.18 77.47,41.91 77.47,39.37 78.74,38.1 U3.28 77.47,34.29 77.47,16.51 v74.93,13.97 | v49.53,12.7 SV1.36
  Bottom 0.254: v49.53,12.7 50.8,13.97 v74.93,13.97 | IC1.17 36.83,45.72 v78.74,45.72
D6  (via drill 0.61)
  Top 0.254: IC2.18 31.75,36.83 33.02,38.1 33.02,44.45 31.75,45.72 IC1.18 JP7.11 31.75,57.15 33.02,58.42 33.02,67.31 IC4.18 v36.83,73.66 | v71.12,7.62 80.01,16.51 80.01,34.29 | U3.27 80.01,34.29 | 80.01,34.29 80.01,41.91 81.28,43.18 U2.27 U1.24 81.28,67.31 v76.2,72.39
  Bottom 0.254: SV1.38 53.34,10.16 57.15,10.16 59.69,7.62 v71.12,7.62 | v36.83,73.66 57.15,73.66 58.42,72.39 v76.2,72.39
D7  (via drill 0.61)
  Top 0.254: IC2.19 29.21,38.1 30.48,39.37 30.48,44.45 29.21,45.72 IC1.19 JP7.10 29.21,57.15 30.48,58.42 30.48,67.31 IC4.19 v35.56,74.93 | U1.25 U2.26 v83.82,50.8 83.82,43.18 82.55,41.91 82.55,34.29 | v71.12,5.08 82.55,16.51 82.55,34.29 | U3.26 82.55,34.29 | v57.15,77.47 57.15,67.31 59.69,64.77 v59.69,52.07
  Bottom 0.254: SV1.40 58.42,5.08 v71.12,5.08 | v35.56,74.93 36.83,76.2 55.88,76.2 v57.15,77.47 | v59.69,52.07 60.96,50.8 v83.82,50.8
GND  (via drill 0.61)
  Top 0.61: C15.2 57.15,2.54 46.99,2.54 SV1.33 45.72,7.62 v45.72,20.32 | U2.1 C8.2 | IC2.14 39.37,33.02 38.1,34.29 38.1,36.83 39.37,38.1 IC1.14 | SV1.8 12.7,7.62 10.16,7.62 10.16,5.08 2.54,5.08 C9.2 | C11.2 93.98,73.66 93.98,80.01 90.17,83.82 C14.2 90.17,87.63 QG2.4 87.63,95.25 JP2.4 | SJ1.1 55.88,88.9 55.88,90.17 X1.5 | QG1.4 72.39,88.9 C13.2 74.93,85.09 78.74,85.09 JP2.1 | C10.2 44.45,39.37 v41.91,41.91 41.91,58.42 IC4.14 40.64,62.23 40.64,76.2 27.94,76.2 27.94,92.71 | IC7.3 53.34,64.77 S1.3 | v60.96,64.77 U1.16 | C3.2 3.81,64.77 3.81,71.12 2.54,72.39 C12.2 | C4.2 C2.- 27.94,92.71 | 22.86,92.71 27.94,92.71 | IC3.8 24.13,78.74 22.86,80.01 22.86,92.71 | 22.86,92.71 C1.- | v12.7,76.2 13.97,74.93 IC3.4 | U1.17 v63.5,68.58
  Bottom 0.61: JP9.1 96.52,10.16 76.2,10.16 72.39,6.35 C15.2 | IC1.14 U2.1 | C9.2 10.16,34.29 10.16,43.18 | C7.2 10.16,43.18 | IC1.14 36.83,43.18 10.16,43.18 | IC2.14 v45.72,20.32 | 53.34,85.09 48.26,85.09 48.26,83.82 46.99,83.82 IC8.3 | 53.34,85.09 53.34,83.82 54.61,83.82 IC6.3 | 53.34,85.09 53.34,87.63 55.88,90.17 X1.5 57.15,90.17 59.69,87.63 69.85,87.63 71.12,88.9 | QG1.4 71.12,88.9 | QG2.4 86.36,88.9 71.12,88.9 | U1.17 U1.16 | IC4.14 41.91,63.5 49.53,63.5 50.8,64.77 53.34,64.77 | 53.34,64.77 v60.96,64.77 | 53.34,64.77 S1.3 | 7.62,95.25 5.08,95.25 3.81,93.98 J1.GNDBREAK | IC3.4 IC3.5 19.05,76.2 21.59,76.2 IC3.8 | C1.- 22.86,93.98 IC5.2 13.97,95.25 7.62,95.25 | v12.7,76.2 C12.2 | 7.62,95.25 J1.GND | v63.5,68.58 C11.2 | IC1.14 40.64,41.91 v41.91,41.91
IRQ  (via drill 0.61)
  Top 0.254: 55.88,50.8 U2.4 55.88,39.37 57.15,38.1 57.15,30.48 55.88,29.21 v55.88,22.86 | 55.88,50.8 v55.88,52.07 | SV1.4 8.89,15.24 12.7,19.05 v12.7,25.4 | v62.23,57.15 62.23,53.34 59.69,50.8 55.88,50.8
  Bottom 0.254: v55.88,52.07 RN1.5 | v12.7,25.4 26.67,25.4 27.94,24.13 44.45,24.13 45.72,22.86 v55.88,22.86 | U1.26 83.82,58.42 68.58,58.42 67.31,57.15 v62.23,57.15
N$1  (via drill 0.61)
  Top 0.254: v58.42,81.28 55.88,78.74 55.88,67.31 57.15,66.04 57.15,57.15 U2.37
  Bottom 0.254: QG1.5 71.12,81.28 v58.42,81.28
N$2  (via drill 0.61)
  Top 0.254: IC3.7 21.59,71.12 20.32,69.85 v20.32,63.5 | v21.59,45.72 22.86,44.45 22.86,38.1 21.59,36.83 IC2.22
  Bottom 0.254: IC2.22 24.13,38.1 IC2.20 | v20.32,63.5 20.32,57.15 12.7,57.15 12.7,50.8 11.43,50.8 10.16,49.53 10.16,45.72 v21.59,45.72
N$3  (via drill 0.61)
  Top 0.254: v49.53,83.82 49.53,87.63 50.8,88.9 X1.3 50.8,90.17
  Bottom 0.254: v49.53,83.82 52.07,83.82 IC6.4
N$4  (via drill 0.61)
  Top 0.254: v45.72,85.09 46.99,86.36 46.99,88.9 48.26,90.17 X1.2
  Bottom 0.254: v45.72,85.09 IC8.2
N$5  (via drill 0.61)
  Top 0.254: X1.7 49.53,92.71 49.53,88.9 48.26,87.63 SJ1.3 48.26,83.82 49.53,82.55 49.53,80.01 v50.8,78.74
  Bottom 0.254: JP2.7 95.25,97.79 97.79,97.79 97.79,69.85 86.36,69.85 81.28,74.93 72.39,74.93 72.39,78.74 v50.8,78.74
N$7
  Top 0.254: QG2.5 81.28,82.55 81.28,78.74 U1.6
N$9  (via drill 0.61)
  Top 0.254: 68.58,82.55 v66.04,85.09 | U1.10 68.58,82.55 | JP2.5 87.63,97.79 68.58,97.79 68.58,82.55
  Bottom 0.254: v66.04,85.09 IC6.2 54.61,85.09
N$11  (via drill 0.61)
  Top 0.254: U1.12 v63.5,82.55 | v91.44,85.09 JP2.6
  Bottom 0.254: IC8.4 44.45,83.82 45.72,82.55 46.99,82.55 48.26,81.28 57.15,81.28 58.42,82.55 v63.5,82.55 69.85,82.55 72.39,85.09 v91.44,85.09
N$12  (via drill 0.61)
  Top 0.61: IC5.1 12.7,96.52 v12.7,93.98
  Bottom 0.61: IC5.1 22.86,96.52 C1.+ | v12.7,93.98 10.16,91.44 7.62,91.44 J1.PWR
NMI  (via drill 0.61)
  Top 0.254: v57.15,49.53 60.96,45.72 U2.6 60.96,39.37 59.69,38.1 59.69,21.59 | v54.61,3.81 59.69,8.89 59.69,21.59 | v66.04,30.48 63.5,27.94 63.5,22.86 62.23,21.59 59.69,21.59
  Bottom 0.254: v57.15,49.53 RN1.4 | SV1.6 12.7,7.62 15.24,7.62 15.24,2.54 53.34,2.54 v54.61,3.81 | U3.21 91.44,30.48 v66.04,30.48
PA0
  Top 0.254: JP6.8 U3.2
PA1
  Top 0.254: JP6.7 U3.3
PA2
  Top 0.254: JP6.6 U3.4
PA3
  Top 0.254: JP6.5 U3.5
PA4
  Top 0.254: JP6.4 U3.6
PA5
  Top 0.254: JP6.3 U3.7
PA6
  Top 0.254: JP6.2 U3.8
PA7
  Top 0.254: JP6.1 U3.9
PB0
  Top 0.254: JP5.1 U3.10
PB1
  Top 0.254: JP5.2 U3.11
PB2
  Top 0.254: JP5.3 U3.12
PB3
  Top 0.254: JP5.4 U3.13
PB4
  Top 0.254: JP5.5 U3.14
PB5
  Top 0.254: JP5.6 U3.15
PB6
  Top 0.254: JP5.7 U3.16
PB7
  Top 0.254: JP5.8 U3.17
PHI  (via drill 0.61)
  Top 0.254: U3.25 85.09,36.83 v85.09,49.53 85.09,57.15 U1.27 | IC1.26 JP7.3 11.43,57.15 12.7,58.42 12.7,67.31 IC4.26 | SV1.2 5.08,10.16 v5.08,50.8 | v50.8,50.8 U2.39
  Bottom 0.254: v5.08,50.8 8.89,54.61 10.16,54.61 JP7.3 | IC1.26 13.97,50.8 v50.8,50.8 57.15,50.8 58.42,49.53 v85.09,49.53
R/W  (via drill 0.61)
  Top 0.254: IC1.27 JP7.2 8.89,57.15 10.16,58.42 10.16,67.31 IC4.27 | U3.22 92.71,36.83 92.71,59.69 U1.28 | v60.96,68.58 62.23,67.31 62.23,58.42 63.5,57.15 U2.34
  Bottom 0.254: U2.34 64.77,54.61 77.47,54.61 77.47,57.15 86.36,57.15 88.9,59.69 90.17,59.69 U1.28 | JP7.2 12.7,59.69 12.7,62.23 15.24,64.77 45.72,64.77 48.26,67.31 50.8,67.31 52.07,68.58 v60.96,68.58
RES  (via drill 0.61)
  Top 0.254: v48.26,44.45 U2.40 IC7.1 48.26,64.77 S1.1 | v83.82,67.31 U1.4 | SV1.3 7.62,7.62 v7.62,25.4 | U3.34 v63.5,30.48 | v54.61,30.48 v54.61,41.91
  Bottom 0.254: RN1.2 v48.26,44.45 50.8,41.91 v54.61,41.91 | v83.82,67.31 52.07,67.31 50.8,66.04 48.26,66.04 S1.1 | v7.62,25.4 12.7,30.48 v54.61,30.48 v63.5,30.48
RTS
  Bottom 0.254: U1.8 78.74,81.28 96.52,81.28 96.52,95.25 | JP2.8 96.52,95.25 | 96.52,95.25 54.61,95.25 52.07,92.71 X1.8
SOB  (via drill 0.61)
  Top 0.254: U2.38 v53.34,46.99 52.07,45.72 v52.07,36.83 | SV1.1 3.81,8.89 v3.81,20.32 | v31.75,22.86 33.02,24.13 v33.02,33.02
  Bottom 0.254: v53.34,46.99 RN1.3 | v3.81,20.32 7.62,24.13 26.67,24.13 27.94,22.86 v31.75,22.86 | v33.02,33.02 33.02,38.1 45.72,38.1 46.99,36.83 v52.07,36.83
VCC  (via drill 0.61)
  Top 0.61: C11.1 U1.2 88.9,83.82 81.28,91.44 | QG1.8 81.28,83.82 81.28,91.44 | JP2.2 81.28,91.44 | v46.99,58.42 41.91,63.5 41.91,81.28 39.37,83.82 | 39.37,83.82 31.75,91.44 C2.+ C4.1 | 39.37,83.82 v40.64,85.09 | C13.1 73.66,90.17 v73.66,96.52 | RN1.1 45.72,40.64 45.72,27.94 C10.1 v44.45,11.43 | U2.2 C8.1 | IC2.1 IC2.28 6.35,38.1 7.62,39.37 7.62,43.18 6.35,44.45 IC1.28 JP7.1 5.08,57.15 5.08,69.85 | v19.05,78.74 IC3.6 | 5.08,69.85 IC4.28 | 5.08,69.85 5.08,80.01 IC3.16 | v15.24,78.74 IC5.3
  Bottom 0.61: C13.1 78.74,87.63 91.44,87.63 C14.1 | QG2.8 95.25,86.36 C14.1 | C14.1 92.71,83.82 81.28,83.82 QG1.8 | 44.45,86.36 45.72,87.63 50.8,87.63 52.07,86.36 IC6.5 | IC7.2 48.26,58.42 v46.99,58.42 | IC5.3 16.51,90.17 29.21,90.17 C2.+ | 44.45,86.36 43.18,85.09 v40.64,85.09 | 44.45,86.36 IC8.5 | v73.66,96.52 72.39,97.79 C4.1 | SV1.15 25.4,5.08 30.48,5.08 30.48,7.62 35.56,7.62 SV1.26 38.1,7.62 43.18,7.62 43.18,11.43 v44.45,11.43 63.5,11.43 | 63.5,11.43 64.77,12.7 93.98,12.7 95.25,13.97 95.25,17.78 JP8.3 | 63.5,11.43 C15.1 | U3.24 86.36,38.1 C8.1 | U2.2 48.26,43.18 45.72,43.18 RN1.1 41.91,44.45 10.16,44.45 IC1.28 5.08,48.26 C7.1 | IC2.27 7.62,34.29 | 7.62,34.29 C9.1 | IC2.28 7.62,34.29 | C3.1 5.08,68.58 IC4.28 | IC3.16 5.08,81.28 C12.1 v15.24,78.74 v19.05,78.74
VDD  (via drill 0.61)
  Top 0.254: v67.31,25.4 67.31,36.83 66.04,38.1 U2.8 66.04,43.18 67.31,44.45 v67.31,58.42 | v58.42,58.42 U1.15
  Bottom 0.254: v67.31,25.4 92.71,25.4 96.52,21.59 U3.20 | v67.31,58.42 v58.42,58.42
VSS  (via drill 0.61)
  Top 0.254: v48.26,29.21 U3.1 | v96.52,29.21 97.79,30.48 97.79,54.61 U2.21 v96.52,71.12
  Bottom 0.254: v96.52,29.21 v48.26,29.21 | v96.52,71.12 U1.1

### Text on the board
Top: 6502 SBC | By Zack Nelson | and 6502.org